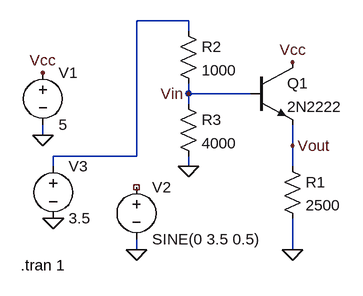
[diagram p0: schematic Voltage_Follower_Replacement.asc]
Voltage_Follower_Replacement.asc, the LTspice schematic file:
Version 4
SHEET 1 880 680
WIRE 48 80 -32 80
WIRE 48 96 48 80
WIRE 48 192 48 176
WIRE 144 192 48 192
WIRE 48 208 48 192
WIRE -176 256 -176 240
WIRE 208 272 208 240
WIRE -32 288 -32 80
WIRE -32 288 -160 288
WIRE -160 304 -160 288
WIRE 48 304 48 288
WIRE 208 304 208 272
WIRE -32 432 -32 416
WIRE 208 432 208 384
FLAG -176 160 Vcc
FLAG 208 144 Vcc
FLAG -32 432 0
FLAG -176 256 0
FLAG 208 432 0
FLAG 208 272 Vout
FLAG 48 192 Vin
FLAG 48 304 0
FLAG -160 384 0
SYMBOL npn 144 144 R0
SYMATTR InstName Q1
SYMATTR Value 2N2222
SYMBOL voltage -176 144 R0
WINDOW 123 0 0 Left 0
WINDOW 39 0 0 Left 0
SYMATTR InstName V1
SYMATTR Value 5
SYMBOL voltage -32 320 R0
WINDOW 123 0 0 Left 0
WINDOW 39 0 0 Left 0
SYMATTR InstName V2
SYMATTR Value SINE(0 3.5 0.5)
SYMBOL res 192 288 R0
SYMATTR InstName R1
SYMATTR Value 2500
SYMBOL res 32 80 R0
SYMATTR InstName R2
SYMATTR Value 1000
SYMBOL res 32 192 R0
SYMATTR InstName R3
SYMATTR Value 4000
SYMBOL voltage -160 288 R0
WINDOW 123 0 0 Left 0
WINDOW 39 0 0 Left 0
SYMATTR InstName V3
SYMATTR Value 3.5
TEXT -210 456 Left 2 !.tran 1

The netlist it stands for:
* Voltage_Follower_Replacement.asc
Q1 Vcc Vin Vout 0 2N2222
V1 Vcc 0 5
V2 NC_01 0 SINE(0 3.5 0.5)
R1 Vout 0 2500
R2 N001 Vin 1000
R3 Vin 0 4000
V3 N001 0 3.5
.model NPN NPN
.model PNP PNP
.lib standard.bjt
.tran 1
.backanno
.end